# EAGLE design can (EAGLE 6.6.0)
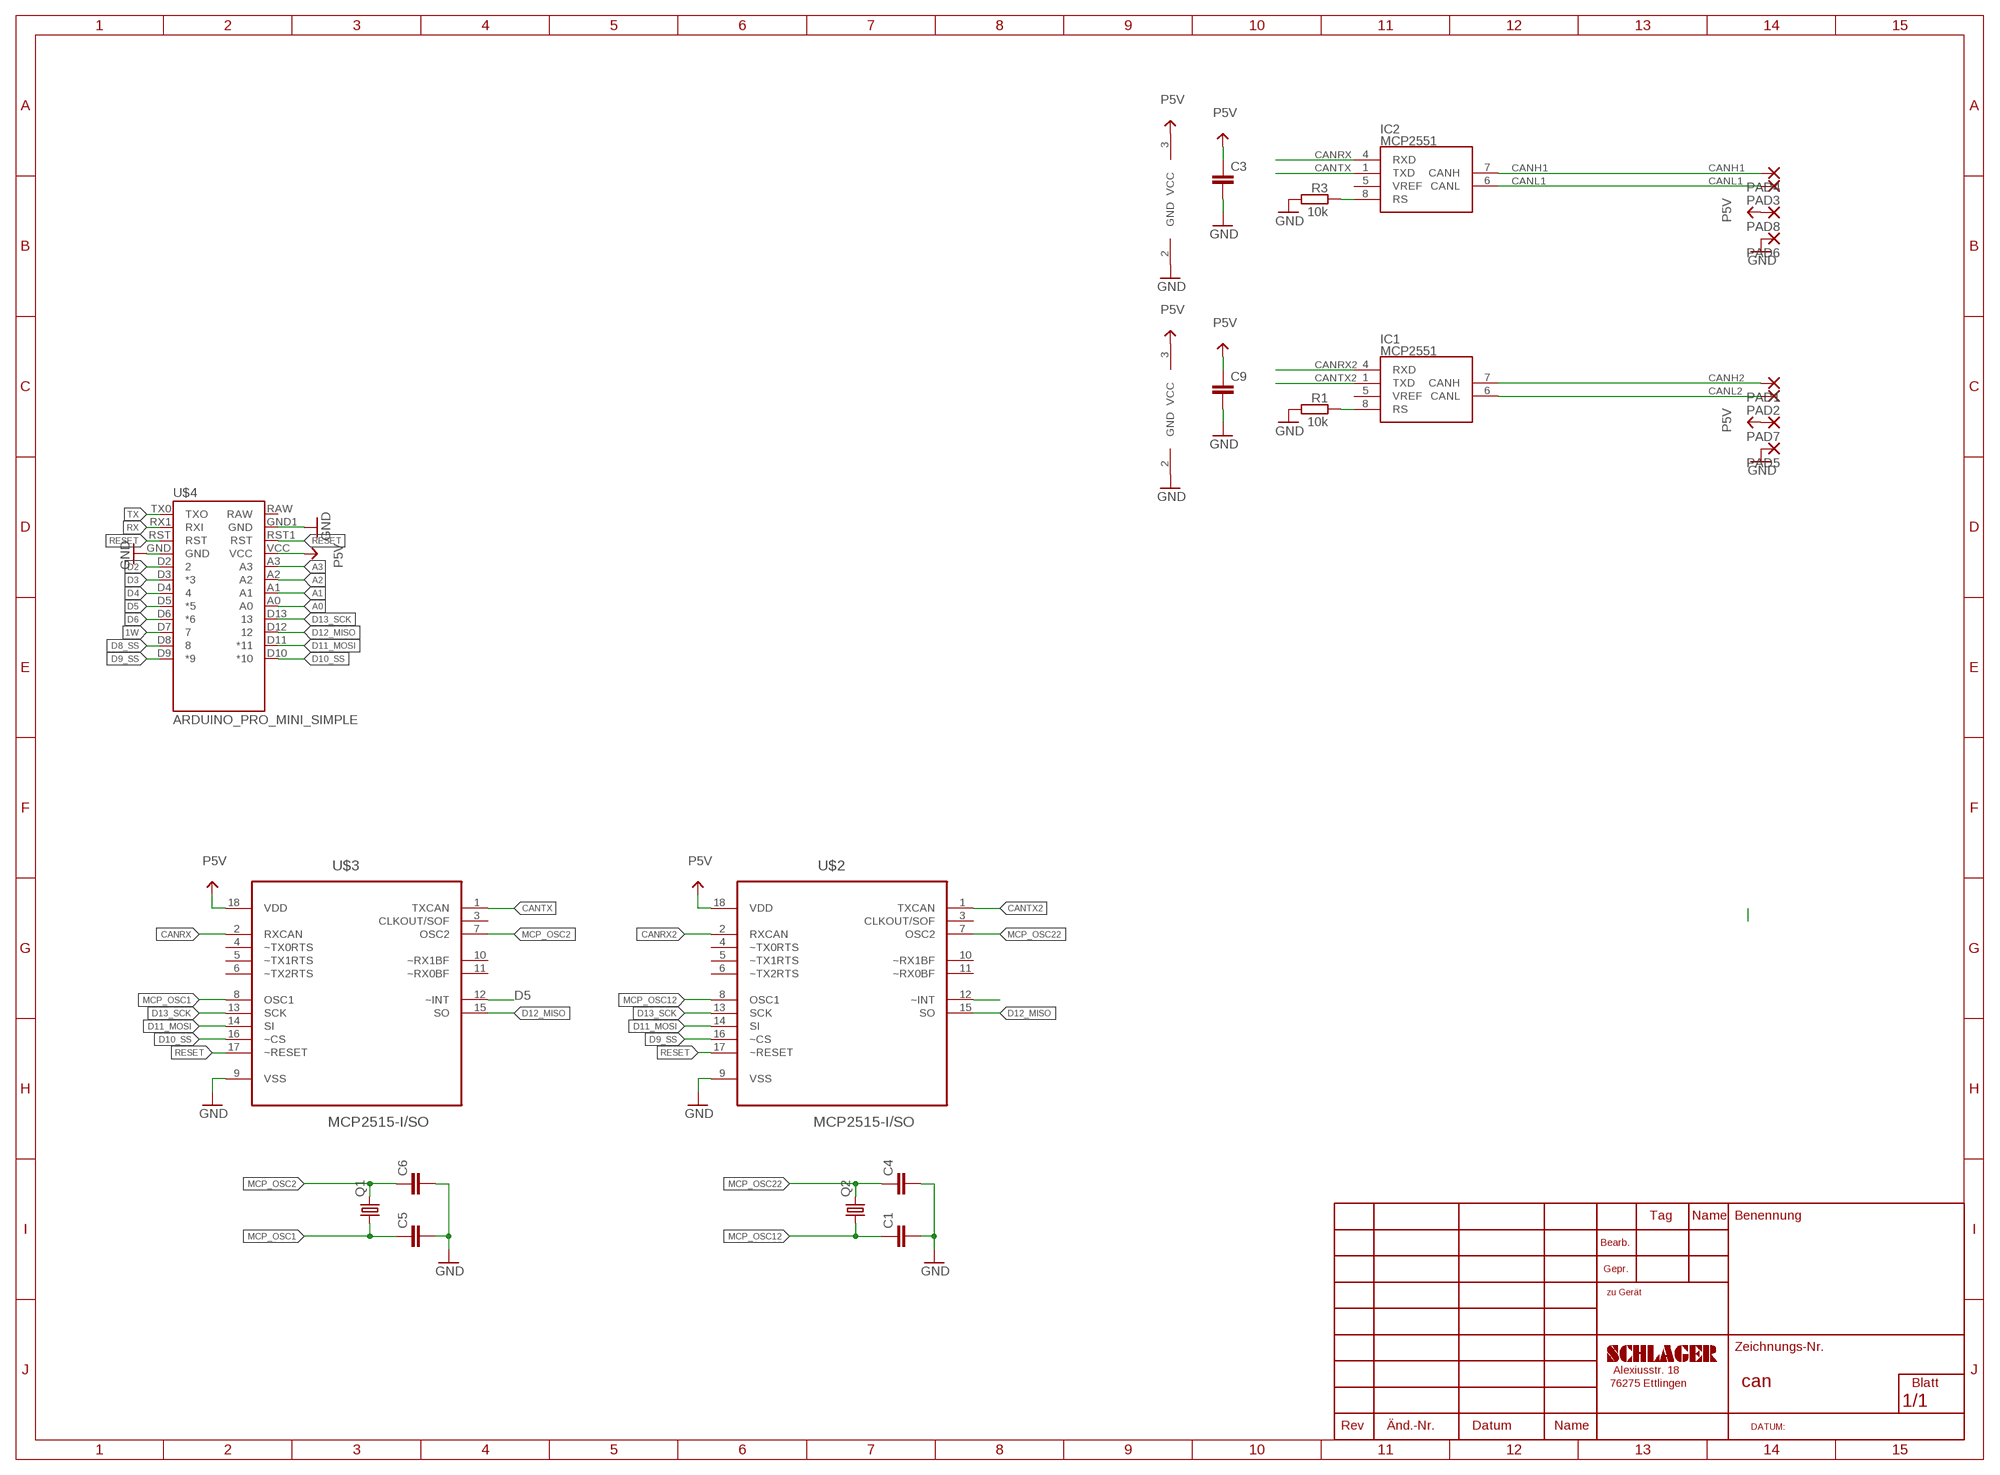
[diagram p0: schematic, sheet 1]

## Parts
C1  C-EUC0805  [C0805]
C3  C-EUC0805  [C0805]
C4  C-EUC0805  [C0805]
C5  C-EUC0805  [C0805]
C6  C-EUC0805  [C0805]
C9  C-EUC0805  [C0805]
IC1  MCP2551  [SO-8]
IC2  MCP2551  [SO-8]
PAD1  SMD2  [SMD1,27-2,54]
PAD2  SMD2  [SMD1,27-2,54]
PAD3  SMD2  [SMD1,27-2,54]
PAD4  SMD2  [SMD1,27-2,54]
PAD5  SMD2  [SMD1,27-2,54]
PAD6  SMD2  [SMD1,27-2,54]
PAD7  SMD2  [SMD1,27-2,54]
PAD8  SMD2  [SMD1,27-2,54]
Q1  CRYSTALHC49S  [HC49/S]
Q2  CRYSTALHC49S  [HC49/S]
R1  10k  R-EU_R0603  [R0603]
R3  10k  R-EU_R0603  [R0603]
U$2  MCP2515-I/SO  [SOIC127P1034X264-18N]
U$3  MCP2515-I/SO  [SOIC127P1034X264-18N]
U$4  ARDUINO_PRO_MINI_SIMPLE  [PRO_MINI_SIMPLE]

## Nets
1W: U$4.D7
A0: U$4.A0
A1: U$4.A1
A2: U$4.A2
A3: U$4.A3
CANH1: IC2.7(CANH) PAD4.1(P)
CANH2: IC1.7(CANH) PAD1.1(P)
CANL1: IC2.6(CANL) PAD3.1(P)
CANL2: IC1.6(CANL) PAD2.1(P)
CANRX: IC2.4(RXD) U$3.2(RXCAN)
CANRX2: IC1.4(RXD) U$2.2(RXCAN)
CANTX: IC2.1(TXD) U$3.1(TXCAN)
CANTX2: IC1.1(TXD) U$2.1(TXCAN)
D2: U$4.D2
D3: U$4.D3(*3)
D4: U$4.D4
D5: U$3.12(~INT) U$4.D5(*5)
D6: U$2.12(~INT) U$4.D6(*6)
D8_SS: U$4.D8
D9_SS: U$2.16(~CS) U$4.D9(*9)
D10_SS: U$3.16(~CS) U$4.D10(*10)
D11_MOSI: U$2.14(SI) U$3.14(SI) U$4.D11(*11)
D12_MISO: U$2.15(SO) U$3.15(SO) U$4.D12
D13_SCK: U$2.13(SCK) U$3.13(SCK) U$4.D13
GND: C1.2 C3.2 C4.2 C5.2 C6.2 C9.2 IC1.2(GND) IC2.2(GND) PAD5.1(P) PAD6.1(P) R1.2 R3.2 U$2.9(VSS) U$3.9(VSS) U$4.GND U$4.GND1(GND)
MCP_OSC1: C5.1 Q1.1 U$3.8(OSC1)
MCP_OSC2: C6.1 Q1.2 U$3.7(OSC2)
MCP_OSC12: C1.1 Q2.1 U$2.8(OSC1)
MCP_OSC22: C4.1 Q2.2 U$2.7(OSC2)
N$1: IC1.8(RS) R1.1
N$2: IC2.8(RS) R3.1
P5V: C3.1 C9.1 IC1.3(VCC) IC2.3(VCC) PAD7.1(P) PAD8.1(P) U$2.18(VDD) U$3.18(VDD) U$4.VCC
RESET: U$2.17(~RESET) U$3.17(~RESET) U$4.RST U$4.RST1(RST)
RX: U$4.RX1(RXI)
TX: U$4.TX0(TXO)
Unconnected: IC1.5(VREF) IC2.5(VREF) U$2.3(CLKOUT/SOF) U$2.4(~TX0RTS) U$2.5(~TX1RTS) U$2.6(~TX2RTS) U$2.10(~RX1BF) U$2.11(~RX0BF) U$3.3(CLKOUT/SOF) U$3.4(~TX0RTS) U$3.5(~TX1RTS) U$3.6(~TX2RTS) U$3.10(~RX1BF) U$3.11(~RX0BF) U$4.RAW

## Library data of the parts
C1 C3-C6 C9 = schlager_passiv:C-EU: CAPACITOR, European symbol
IC1 IC2 = MYMCHIP:MCP2551: CAN Transceiver
PAD1-PAD8 = wirepad:SMD2: SMD PAD
Q1 Q2 = crystal:CRYSTAL: CRYSTAL; OC_FARNELL: 1667008; OC_NEWARK: unknown
R1 R3 = rcl:R-EU_: RESISTOR, European symbol
U$2 U$3 = schlager_ics:MCP2515-I/SO: CAN Controller; MPN: MCP2515-I/SO; OC_FARNELL: 1292239; OC_NEWARK: 29H7136; PACKAGE: SOIC-18; SUPPLIER: Microchip
U$4 = debauer_modules:ARDUINO_PRO_MINI_SIMPLE

## Net classes
4 USBpair: width 0.254 mm, drill 0.406 mm, clearance 0.508 mm

## Board
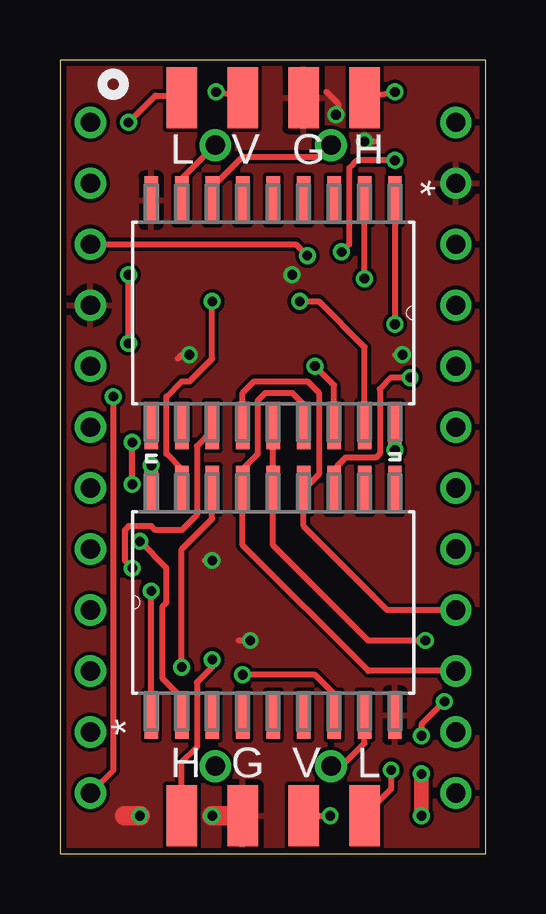
[diagram p1: board, top side]
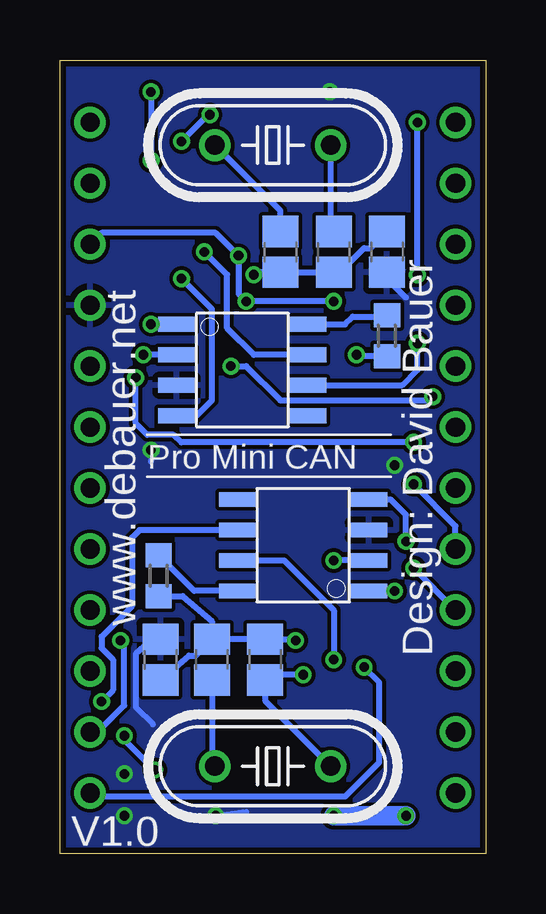
[diagram p2: board, bottom side, seen from below]

Size 17.77 x 33.08 mm. Coordinates in mm from the lower left corner, seen from the top.
Outline: 0,0 17.77,0 17.77,33.08 0,33.08 0,0
Copper layers (1*16): Top 0.035mm / dielectric 1.5mm / Bottom 0.035mm
Design rules "ITEADstudio_DRC": minimum track width 6mil, minimum drill 12mil, track to track 6mil, track to pad 6mil, pad to pad 6mil, via to via 6mil, smd to smd 0mil, copper to edge 10mil, drill to drill 10mil, minimum pad ring 10mil, minimum via ring 6mil, stop-mask expansion 2mil, vias tented up to drill 100mil, thermal gap 10mil

### Footprints (pad centres in the part's own frame; a part is rotated, then mirrored left to right if it is on the bottom)
C0805 = smd 1.3 x 1.5: 1 -0.85,0; 2 0.85,0
SO-8 = smd 0.61 x 1.524: 1 0,-0.203; 2 1.27,-0.203; 3 2.54,-0.203; 4 3.81,-0.203; 5 3.81,5.283; 6 2.54,5.283; 7 1.27,5.283; 8 0,5.283
SMD1,27-2,54 = smd 1.27 x 2.54: 1 0,0
HC49/S = drill 0.813: 1 -2.413,0; 2 2.413,0
R0603 = smd 1 x 1.1: 1 -0.85,0; 2 0.85,0
SOIC127P1034X264-18N = smd 1.981 x 0.559: 1 -4.699,5.08; 2 -4.699,3.81; 3 -4.699,2.54; 4 -4.699,1.27; 5 -4.699,0; 6 -4.699,-1.27; 7 -4.699,-2.54; 8 -4.699,-3.81; 9 -4.699,-5.08; 10 4.699,-5.08; 11 4.699,-3.81; 12 4.699,-2.54; 13 4.699,-1.27; 14 4.699,0; 15 4.699,1.27; 16 4.699,2.54; 17 4.699,3.81; 18 4.699,5.08
PRO_MINI_SIMPLE = drill 0.8: A0 7.62,3.81; A1 7.62,1.27; A2 7.62,-1.27; A3 7.62,-3.81; D2 -7.62,3.81; D3 -7.62,1.27; D4 -7.62,-1.27; D5 -7.62,-3.81; D6 -7.62,-6.35; D7 -7.62,-8.89; D8 -7.62,-11.43; D9 -7.62,-13.97; D10 7.62,-13.97; D11 7.62,-11.43; D12 7.62,-8.89; D13 7.62,-6.35; GND 7.62,11.43; GND1 -7.62,6.35; RAW 7.62,13.97; RST 7.62,8.89; RST1 -7.62,8.89; RX1 -7.62,11.43; TX0 -7.62,13.97; VCC 7.62,6.35

### Placement (x,y rotation side)
C1  6.35,25.08 270 bottom
C3  13.57,8.1 270 bottom
C4  8.57,25.08 270 bottom
C5  11.43,8.1 90 bottom
C6  9.21,8.1 90 bottom
C9  4.13,25.08 90 bottom
IC1  12.7,22.07 270 bottom
IC2  5.08,10.95 90 bottom
PAD1  12.7,31.51 0 top
PAD2  5.08,31.51 0 top
PAD3  12.7,1.59 0 top
PAD4  5.08,1.59 0 top
PAD5  7.62,1.59 0 top
PAD6  10.16,31.51 0 top
PAD7  10.16,1.59 0 top
PAD8  7.62,31.51 0 top
Q1  8.89,3.65 0 bottom
Q2  8.89,29.53 180 bottom
R1  4.13,21.59 270 bottom
R3  13.65,11.59 270 bottom
U$2  8.89,22.54 270 top
U$3  8.89,10.48 90 top
U$4  8.89,16.51 0 top

### Tracks (layer width: path | path; a pad name or v marks a point on that pad's centre or on a via)
CANH1  (via drill 0.4)
  Top 0.254: v6.35,8.1 6.35,7.78 5.71,7.14 5.71,4.45 5.08,3.81 PAD4.1
  Bottom 0.254: IC2.7 8.41,12.22 6.35,10.16 v6.35,8.1
CANH2  (via drill 0.4)
  Top 0.254: v11.75,25.08 12.06,25.4 12.06,28.57 12.38,28.89 v13.97,28.89 | PAD1.1 v13.97,31.75
  Bottom 0.254: IC1.7 9.68,20.8 10.79,21.91 10.79,24.13 v11.75,25.08 | v13.97,31.75 v13.97,28.89
CANL1  (via drill 0.4)
  Top 0.254: v16.03,6.35 15.08,5.4 v15.08,4.92 | v13.81,3.49 13.81,2.7 PAD3.1
  Bottom 0.254: IC2.6 14.45,13.49 14.76,13.18 14.76,10.32 16.03,9.05 16.03,8.57 15.56,8.1 15.56,6.83 v16.03,6.35 | v15.08,4.92 15.08,4.76 v13.81,3.49
CANL2  (via drill 0.4)
  Top 0.254: v2.86,21.27 v2.86,24.13 | v2.86,30.48 3.97,31.59 4.92,31.59 PAD2.1
  Bottom 0.254: IC1.6 3.49,19.53 2.86,20.16 v2.86,21.27 | v2.86,24.13 v2.86,30.48
CANRX  (via drill 0.4)
  Top 0.254: U$3.2 5.08,6.51 4.29,7.3 4.29,10.32 4.45,10.48 4.45,11.91 v3.33,13.02
  Bottom 0.254: v3.33,13.02 3.33,14.13 3.97,14.76 IC2.4
CANRX2  (via drill 0.4)
  Top 0.254: v12.7,23.97 U$2.2
  Bottom 0.254: IC1.4 12.06,18.26 11.43,18.89 11.43,22.7 v12.7,23.97
CANTX  (via drill 0.4)
  Top 0.254: U$3.1 v3.81,10.95
  Bottom 0.254: v3.81,10.95 IC2.1
CANTX2  (via drill 0.4)
  Top 0.254: U$2.1 v13.97,22.07
  Bottom 0.254: v13.97,22.07 IC1.1
D5  (via drill 0.4)
  Top 0.254: v14.61,19.84 13.81,19.84 13.34,19.37 13.34,16.67 13.18,16.51 11.91,16.51 11.59,16.19 11.59,15.34 U$3.12 | v3.02,15.4 v3.02,17.14
  Bottom 0.254: U$4.D5 1.27,13.65 v3.02,15.4 | v14.61,19.84 14.61,17.94 14.13,17.46 13.02,17.46 12.7,17.14 v3.02,17.14
D6  (via drill 0.4)
  Top 0.254: U$2.12 6.35,17.62 5.71,16.99 5.71,14.13 5.08,13.49 3.97,13.49 3.81,13.65 2.86,13.65 2.7,13.49 2.7,12.22 v3.02,11.91
  Bottom 0.254: v3.02,11.91 U$4.D6
D9_SS  (via drill 0.4)
  Top 0.254: U$2.16 11.43,19.53 v10.64,20.32 | v2.22,19.05 2.22,3.49 U$4.D9
  Bottom 0.254: v10.64,20.32 10,20.32 8.57,18.89 2.38,18.89 v2.22,19.05
D10_SS  (via drill 0.4)
  Top 0.254: v5.08,7.78 5.08,12.7 6.35,13.97 U$3.16
  Bottom 0.254: v5.08,7.78 4.45,7.14 4.45,3.81 5.87,2.38 16.35,2.38 U$4.D10
D11_MOSI  (via drill 0.4)
  Top 0.254: U$2.14 U$3.14 9.05,15.02 9.05,14.61 8.89,14.45 8.89,12.86 12.86,8.89 v15.24,8.89
  Bottom 0.254: U$4.D11 16.19,5.08 15.08,6.19 15.08,8.73 v15.24,8.89
D12_MISO
  Top 0.254: U$2.15 10.16,18.73 9.68,19.21 8.57,19.21 8.26,18.89 8.26,16.67 7.62,16.03 U$3.15 7.62,12.86 12.86,7.62 U$4.D12
D13_SCK
  Top 0.254: U$2.13 7.62,19.21 8.1,19.68 10.32,19.68 10.79,19.21 10.79,15.81 U$3.13 10.16,13.65 13.65,10.16 U$4.D13
GND  (via drill 0.4)
  Top 0.254: v9.68,24.13 9.84,24.29 | v14.29,20.8 13.97,20.8 | v5.4,20.8 5.08,20.8 4.92,20.64 | v6.35,12.22 6.03,12.22 | v7.94,8.89 7.46,8.89 | 11.11,31.75 11.59,31.27 11.59,30.72 | 11.59,30.64 11.59,30.72 | 11.59,30.72 v11.51,30.8 | v12.7,29.69 13.1,29.69
  Top 0.813: PAD5.1 v6.35,1.59 | v3.33,1.59 2.7,1.59
  Bottom 0.254: C9.2 4.82,25.24 5.08,25.24 6.09,24.23 C1.2 C4.2 9.58,24.23 v9.68,24.13 | IC1.2 v14.29,20.8 | R1.2 5.34,20.74 v5.4,20.8 | R3.2 12.64,10.74 11.43,9.68 C5.2 | C5.2 C6.2 7.99,8.95 v7.94,8.89 | C3.2 13.55,7.25 12.38,8.26 12.12,8.26 C5.2 | IC2.2 v6.35,12.22 | v11.51,30.8 11.59,30.8 v12.7,29.69
  Bottom 0.813: v6.35,1.59 v3.33,1.59
  pour Top: -2.54,34.29 21.59,34.29 21.59,-1.27 -2.54,-1.27
MCP_OSC1
  Top 0.254: Q1.1 11.75,3.65 12.7,4.6 U$3.8
  Bottom 0.254: C5.1 11.43,3.78 Q1.1
MCP_OSC2  (via drill 0.4)
  Top 0.254: U$3.7 11.43,6.67 10.64,7.46 v7.62,7.46
  Bottom 0.254: Q1.2 9.21,6.38 C6.1 8.99,7.46 v7.62,7.46
MCP_OSC12
  Top 0.254: U$2.8 5.08,28.13 Q2.1
  Bottom 0.254: Q2.1 6.48,26.06 C1.1
MCP_OSC22
  Top 0.254: U$2.7 6.35,27.78 7.62,29.05 10.83,29.05 Q2.2
  Bottom 0.254: C4.1 8.57,26.8 Q2.2
N$1
  Bottom 0.254: IC1.8 5.87,22.07 5.56,22.38 4.18,22.38 R1.1
N$2
  Bottom 0.254: IC2.8 12.17,10.95 R3.1
P5V  (via drill 0.4)
  Top 0.254: U$3.18 3.87,15.49 v3.81,16.19 | U$2.18 v13.97,16.83 | PAD7.1 v11.27,1.59 | PAD8.1 v6.51,31.75
  Top 0.61: v15.08,3.33 v15.08,1.59
  Bottom 0.254: v3.81,16.19 3.65,16.19 | v13.97,16.83 13.97,16.35 | C3.1 13.91,8.95 14.61,8.33 14.61,6.11 13.89,5.4 | v11.27,1.59 10,1.75 | v6.51,31.75 6.19,31.75 | C9.1 4.13,23.97 3.33,23.18
  pour Bottom: -5.08,36.83 24.13,36.83 24.13,-3.81 -5.08,-3.81
RESET  (via drill 0.4)
  Top 0.254: U$4.RST1 9.84,25.4 v10.32,24.92 | U$2.17 12.7,21.11 10.79,23.02 v10,23.02 | U$3.17 5.08,16.03 4.45,16.67 4.45,19.05 5.08,19.68 5.4,19.68 6.35,20.64 v6.35,23.02
  Bottom 0.254: U$4.RST 16.03,25.88 11.27,25.88 v10.32,24.92 10.32,23.34 v10,23.02 v6.35,23.02

### Text on the board
tPlace: L | V | G | H | H | G | V | L
bPlace: Design: David Bauer | www.debauer.net | Pro Mini CAN | V1.0